# Altium project Sergeant_Soldiered.PrjPcb (part 2 of 2)

## Sheet TIA_SarSol.SchDoc
size Tabloid; DrawnBy: Nicholas Sandor; Revision: V26C (V26.4a); SheetNumber: 4; SheetTotal: 6
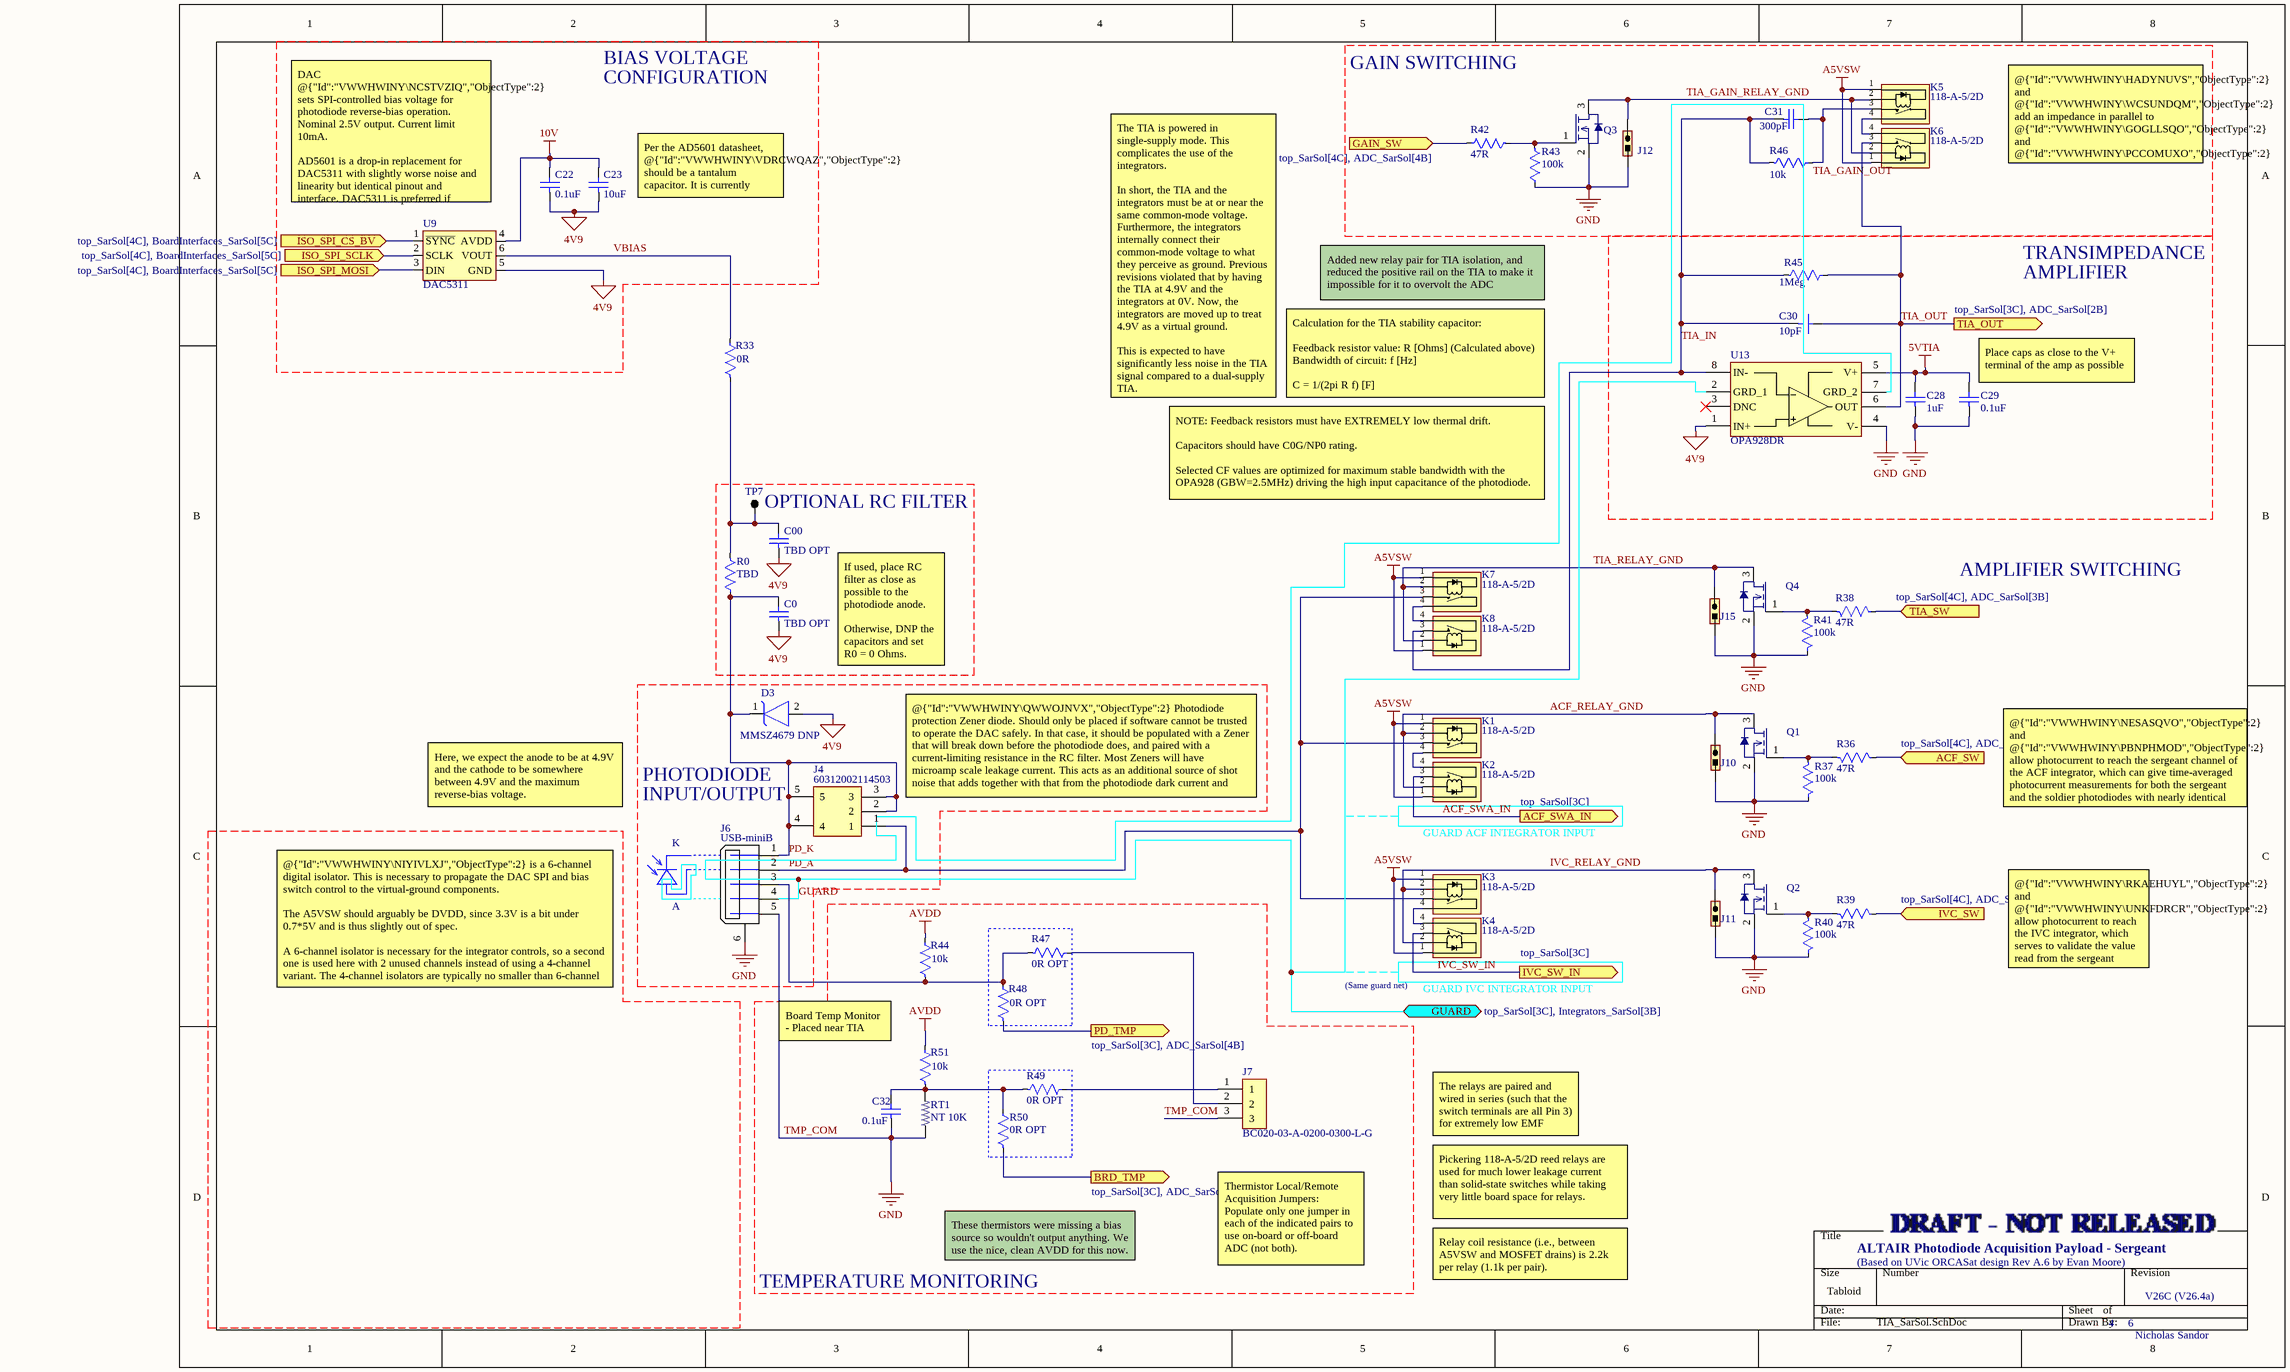
[diagram p3: TIA_SarSol.SchDoc]

### Parts
C00  TBD OPT  [CAP 0603 IPC MID DENSITY]
C0  TBD OPT  [CAP 0603 IPC MID DENSITY]
C22  0.1uF  [CAP 0603 IPC MID DENSITY]
C23  10uF  [CAP 1206 IPC LOW DENSITY]
C28  1uF  [CAP 0603 IPC MID DENSITY]
C29  0.1uF  [CAP 0603 IPC MID DENSITY]
C30  10pF  [CAP 1206 UNKNOWN]
C31  300pF  [CAP 1206 NON-IPC KEMET NP0]
C32  0.1uF  [CAP 0603 IPC MID DENSITY]
D3  MMSZ4679 DNP  [SOD-123 ONSEMI SMALL PADS]
J4  60312002114503  [COAX SMA THT]
J6  USB-miniB  [USB-miniB]
J7  BC020-03-A-0200-0300-L-G  [JUMPER 3POS 1MM PITCH THT]
J10  Jumper  [JUMPER 2POS 1MM PITCH THT]  (value not drawn)
J11  Jumper  [JUMPER 2POS 1MM PITCH THT]  (value not drawn)
J12  Jumper  [JUMPER 2POS 1MM PITCH THT]  (value not drawn)
J15  Jumper  [JUMPER 2POS 1MM PITCH THT]  (value not drawn)
K1  118-A-5/2D  [118-A-5/2D]
K2  118-A-5/2D  [118-A-5/2D]
K3  118-A-5/2D  [118-A-5/2D]
K4  118-A-5/2D  [118-A-5/2D]
K5  118-A-5/2D  [118-A-5/2D]
K6  118-A-5/2D  [118-A-5/2D]
K7  118-A-5/2D  [118-A-5/2D]
K8  118-A-5/2D  [118-A-5/2D]
Q1  DMG2302UK  [SOT90-3 LOW DENSITY]  (value not drawn)
Q2  DMG2302UK  [SOT90-3 LOW DENSITY]  (value not drawn)
Q3  DMG2302UK  [SOT90-3 LOW DENSITY]  (value not drawn)
Q4  DMG2302UK  [SOT90-3 LOW DENSITY]  (value not drawn)
R0  TBD  [RES 0603 IPC MID DENSITY]
R33  0R  [RES 0603 IPC MID DENSITY]
R36  47R  [RES 0603 IPC MID DENSITY]
R37  100k  [RES 0603 IPC MID DENSITY]
R38  47R  [RES 0603 IPC MID DENSITY]
R39  47R  [RES 0603 IPC MID DENSITY]
R40  100k  [RES 0603 IPC MID DENSITY]
R41  100k  [RES 0603 IPC MID DENSITY]
R42  47R  [RES 0603 IPC MID DENSITY]
R43  100k  [RES 0603 IPC MID DENSITY]
R44  10k  [RES 0603 IPC MID DENSITY]
R45  1Meg  [RES 1206 IPC MID DENSITY]
R46  10k  [RES 1206 IPC MID DENSITY]
R47  0R OPT  [RES 0603 IPC MID DENSITY]
R48  0R OPT  [RES 0603 IPC MID DENSITY]
R49  0R OPT  [RES 0603 IPC MID DENSITY]
R50  0R OPT  [RES 0603 IPC MID DENSITY]
R51  10k  [RES 0603 IPC MID DENSITY]
RT1  value NT 10K  [RES 0603 IPC MID DENSITY]  (hidden comment: NTC 0603 10K 1%)
TP7  Testpoint  [TESTPOINT THT]  (value not drawn)  (no BOM)
U9  DAC5311  [SOT363-6 MID DENSITY]
U13  OPA928DR  [8-SOIC 4MM WIDE MID DENSITY]

### Blocks framed on the sheet
GAIN SWITCHING: C31 J12 K5 K6 Q3 R42 R43 R46
OPTIONAL RC FILTER: C0 C00 R0 TP7
TEMPERATURE MONITORING: C32 J7 R44 R47-R51 RT1

### Ports
ACF_SW (in, see top_SarSol[4C], ADC_SarSol[3B]), ACF_SWA_IN (out, see top_SarSol[3C]), BRD_TMP (out, see top_SarSol[3C], ADC_SarSol[4B]), GAIN_SW (in, see top_SarSol[4C], ADC_SarSol[4B]), GUARD (bidir, see top_SarSol[3C], Integrators_SarSol[3B]), ISO_SPI_CS_BV (in, see top_SarSol[4C], BoardInterfaces_SarSol[5C]), ISO_SPI_MOSI (in, see top_SarSol[4C], BoardInterfaces_SarSol[5C]), ISO_SPI_SCLK (in, see top_SarSol[4C], BoardInterfaces_SarSol[5C]), IVC_SW (in, see top_SarSol[4C], ADC_SarSol[3B]), IVC_SW_IN (out, see top_SarSol[3C]), PD_TMP (out, see top_SarSol[3C], ADC_SarSol[4B]), TIA_OUT (out, see top_SarSol[3C], ADC_SarSol[2B]), TIA_SW (in, see top_SarSol[4C], ADC_SarSol[3B])

### Nets
4V9: C00.1 C0.1 C22.1 C23.1 D3.2(Anode) U9.5(GND) U13.1(IN+)
5VTIA: C28.2 C29.2 U13.5(V+)
10V: C22.2 C23.2 U9.4(AVDD)
A5VSW: K1.1 K2.1 K3.1 K4.1 K5.1 K6.1 K7.1 K8.1
AVDD: R44.2 R51.2
GND: C28.1 C29.1 C32.1 J6.5 J6.6(SHLD) J7.3 J10.1 J11.1 J12.1 J15.1 Q1.2(Source) Q2.2(Source) Q3.2(Source) Q4.2(Source) R37.2 R40.2 R41.2 R43.2 RT1.1 U13.4(V-)  [also labelled TMP_COM]  [project net SYS_GND]
ACF_RELAY_GND: J10.2 K1.2 K2.2 Q1.3(Drain)
ACF_SWA_IN: K2.3 ; port ACF_SWA_IN
GUARD: J6.4 U13.2(GRD_1) U13.7(GRD_2) ; port GUARD
IVC_RELAY_GND: J11.2 K3.2 K4.2 Q2.3(Drain)
IVC_SW_IN: K4.3 ; port IVC_SW_IN
PD_A: J4.1 J6.2 K1.3 K3.3 K7.3
PD_K: C0.2 D3.1(Cathode) J4.2 J4.3 J4.4 J4.5 J6.1 R0.2
TIA_GAIN_OUT: C31.2 K5.3 R46.2
TIA_GAIN_RELAY_GND: J12.2 K5.2 K6.2 Q3.3(Drain)
TIA_IN: C30.1 C31.1 K8.3 R45.1 R46.1 U13.8(IN-)
TIA_OUT: C30.2 K6.3 R45.2 U13.6(OUT) ; port TIA_OUT
TIA_RELAY_GND: J15.2 K7.2 K8.2 Q4.3(Drain)
VBIAS: R33.2 U9.6(VOUT)
NetC00_2: C00.2 R0.1 R33.1 TP7.1
NetC32_2: C32.2 R49.1 R50.2 R51.1 RT1.2
NetJ6_3: J6.3 R44.1 R47.1 R48.2
NetJ7_1: J7.1 R49.2
NetJ7_2: J7.2 R47.2
NetK1_4: K1.4 K2.4
NetK3_4: K3.4 K4.4
NetK5_4: K5.4 K6.4
NetK7_4: K7.4 K8.4
NetQ1_1: Q1.1(Gate) R36.1 R37.1
NetQ2_1: Q2.1(Gate) R39.1 R40.1
NetQ3_1: Q3.1(Gate) R42.1 R43.1
NetQ4_1: Q4.1(Gate) R38.1 R41.1
NetR36_2: R36.2 ; port ACF_SW
NetR38_2: R38.2 ; port TIA_SW
NetR39_2: R39.2 ; port IVC_SW
NetR42_2: R42.2 ; port GAIN_SW
NetR48_1: R48.1 ; port PD_TMP
NetR50_1: R50.1 ; port BRD_TMP
NetU9_1: U9.1(~{SYNC}) ; port ISO_SPI_CS_BV
NetU9_2: U9.2(SCLK) ; port ISO_SPI_SCLK
NetU9_3: U9.3(DIN) ; port ISO_SPI_MOSI

Not connected (* = marked no-connect by the designer): U13 3(DNC)*

### Notes on the sheet
- BIAS VOLTAGE
- CONFIGURATION
- DAC @{"Id":"VWWHWINY\NCSTVZIQ","ObjectType":2} sets SPI-controlled bias voltage for photodiode reverse-bias operation. Nominal 2.5V output. Current limit 10mA.
  AD5601 is a drop-in replacement for DAC5311 with slightly worse noise and linearity but identical pinout and interface. DAC5311 is preferred if available.
- (near C23) Per the AD5601 datasheet, @{"Id":"VWWHWINY\VDRCWQAZ","ObjectType":2} should be a tantalum capacitor. It is currently specified as an MLCC.
- @{"Id":"VWWHWINY\HADYNUVS","ObjectType":2} and @{"Id":"VWWHWINY\WCSUNDQM","ObjectType":2} add an impedance in parallel to @{"Id":"VWWHWINY\GOGLLSQO","ObjectType":2} and @{"Id":"VWWHWINY\PCCOMUXO","ObjectType":2} to lower the gain of the TIA, which measures the photocurrent in the case where the laser is not being pulsed.
- TRANSIMPEDANCE
- Added new relay pair for TIA isolation, and reduced the positive rail on the TIA to make it impossible for it to overvolt the ADC
- AMPLIFIER
- The TIA is powered in single-supply mode. This complicates the use of the integrators.
  In short, the TIA and the integrators must be at or near the same common-mode voltage. Furthermore, the integrators internally connect their common-mode voltage to what they perceive as ground. Previous revisions violated that by having the TIA at 4.9V and the integrators at 0V. Now, the integrators are moved up to treat 4.9V as a virtual ground.
  This is expected to have significantly less noise in the TIA signal compared to a dual-supply TIA.
- Calculation for the TIA stability capacitor:
  Feedback resistor value: R [Ohms] (Calculated above)
  Bandwidth of circuit: f [Hz]
  C = 1/(2pi R f) [F]
- (near C29) Place caps as close to the V+ terminal of the amp as possible
- NOTE: Feedback resistors must have EXTREMELY low thermal drift.
  Capacitors should have C0G/NP0 rating.
  Selected CF values are optimized for maximum stable bandwidth with the OPA928 (GBW=2.5MHz) driving the high input capacitance of the photodiode.
- AMPLIFIER SWITCHING
- If used, place RC filter as close as possible to the photodiode anode.
  Otherwise, DNP the capacitors and set R0 = 0 Ohms.
- Here, we expect the anode to be at 4.9V and the cathode to be somewhere between 4.9V and the maximum reverse-bias voltage.
- PHOTODIODE
- INPUT/OUTPUT
- (near J4) @{"Id":"VWWHWINY\QWWOJNVX","ObjectType":2} Photodiode protection Zener diode. Should only be placed if software cannot be trusted to operate the DAC safely. In that case, it should be populated with a Zener that will break down before the photodiode does, and paired with a current-limiting resistance in the RC filter. Most Zeners will have microamp scale leakage current. This acts as an additional source of shot noise that adds together with that from the photodiode dark current and limits measurement precision.
- GUARD ACF INTEGRATOR INPUT
- @{"Id":"VWWHWINY\NESASQVO","ObjectType":2} and @{"Id":"VWWHWINY\PBNPHMOD","ObjectType":2} allow photocurrent to reach the sergeant channel of the ACF integrator, which can give time-averaged photocurrent measurements for both the sergeant and the soldier photodiodes with nearly identical characteristics between the two.
- K
- A
- @{"Id":"VWWHWINY\NIYIVLXJ","ObjectType":2} is a 6-channel digital isolator. This is necessary to propagate the DAC SPI and bias switch control to the virtual-ground components.
  The A5VSW should arguably be DVDD, since 3.3V is a bit under 0.7*5V and is thus slightly out of spec.
  A 6-channel isolator is necessary for the integrator controls, so a second one is used here with 2 unused channels instead of using a 4-channel variant. The 4-channel isolators are typically no smaller than 6-channel isolators.
- (near K4) (Same guard net)
- (near K4) GUARD IVC INTEGRATOR INPUT
- @{"Id":"VWWHWINY\RKAEHUYL","ObjectType":2} and @{"Id":"VWWHWINY\UNKFDRCR","ObjectType":2} allow photocurrent to reach the IVC integrator, which serves to validate the value read from the sergeant channel of the ACF.
- Board Temp Monitor
  - Placed near TIA
- The relays are paired and wired in series (such that the switch terminals are all Pin 3) for extremely low EMF
- These thermistors were missing a bias source so wouldn't output anything. We use the nice, clean AVDD for this now.
- Thermistor Local/Remote Acquisition Jumpers:
  Populate only one jumper in each of the indicated pairs to use on-board or off-board ADC (not both).
- Pickering 118-A-5/2D reed relays are used for much lower leakage current than solid-state switches while taking very little board space for relays.
- ALTAIR Photodiode Acquisition Payload - Sergeant
- (Based on UVic ORCASat design Rev A.6 by Evan Moore)
- Relay coil resistance (i.e., between A5VSW and MOSFET drains) is 2.2k per relay (1.1k per pair).

### Library data of the parts
C00 C0 = CAP: Murata GRT188R61H105KE13D - Cap Ceramic 1uF 10% 50V X5R 0603 (Placeholder); MF: Murata; MP: GRT188R61H105KE13D
C22 C29 C32 = CAP: as C5 on sheet Power_SarSol; MF: Kemet; MP: C0603C104K5RACAUTO
C23 = CAP: Murata GRT319R6YA106KE01D - Cap Ceramic 10uF 35V X5R 10% Pad SMD 1206 85C Automotive T/R; MF: Murata; MP: GRT319R6YA106KE01D
C28 = CAP: Murata GRT188R61H105KE13D - Cap MLCC AEC-Q200 X5R 1uF 50V 0603; MF: Murata; MP: GRT188R61H105KE13D
C30 = CAP: Wurth Elektronik 885012008037 - Cap Ceramic 10pF 5% 50V NP0 1206; MF: Wurth Elektronik; MP: 885012008037
C31 = CAP: Kemet C1206C301K5GACTU - Cap Ceramic 300pF 10% 50V NP0 1206; MF: Kemet; MP: C1206C301K5GACTU
D3 = Zener: DIODE ZENER SOD123; MF: onsemi; MP: MMSZ4679T1G
J4 = 60312002114503: Coaxial, SMA Female Jack, 50 Ohm, Through-Hole; MF: Wurth Elektronik; Datasheet Link: https://katalog.we-online.de/em/datasheet/60312002114503.pdf; Height: 9.56mm; MP: 60312002114503; Mouser Part Number: 710-60312002114503; Mouser Price/Stock: https://www.mouser.co.uk/ProductDetail/Wurth-Elektronik/60312002114503?qs=3jNSNtuqJTL%2FGpZA1FAOxw%3D%3D
J6 = USB-miniB: Conn Mini-USB RCP 5 POS Solder ST Thru-Hole 5 Terminal 1 Port; Number of Positions: 5; Gender: Female; MF: Amphenol Commercial; MP: UE25BE5510H; RoHS: Yes; Category: USB Connectors; Stock 1: 6446; Mount: Through Hole; Color: Black; Contact Material: Copper Alloy; Contact Plating: Gold; Number of Contacts: 5; Termination: PCB; Features: High Temperature; Lead Free: Lead Free; Flammability Rating: UL94 V-0; ComponentLink1URL: http://components.arrow.com/part/dataview/0323_00956300?src-supplier=Arrow+Europe; ComponentLink1Description: http://components.arrow.com/part/dataview/0323_00956300?src-supplier=Arrow+Europe; ComponentLink2URL: http://www.alliedelec.com/m/d/e7e3d7a920045eebbdef787e60d8b001.pdf?src-supplier=Allied+Electronics; ComponentLink2Description: http://www.alliedelec.com/m/d/e7e3d7a920045eebbdef787e60d8b001.pdf?src-supplier=Allied+Electronics; ComponentLink3URL: https://www.amphenolcanada.com/ProductSearch/drawings/AC/UE25BEX510X.pdf?src-supplier=Digi-Key; ComponentLink3Description: https://www.amphenolcanada.com/ProductSearch/drawings/AC/UE25BEX510X.pdf?src-supplier=Digi-Key; Supplier 1: Digi-Key; Supplier Part Number 1: UE25BE5510H-ND
J7 = BC020-03-A-0200-0300-L-G: 3x1 Header SMD; MF: GCT (GLOBAL CONNECTOR TECHNOLOGY); Datasheet Link: https://www.mouser.com/datasheet/2/837/BC020-1948594.pdf; Height: 3.2mm; MP: BC020-03-A-0200-0300-L-G
J10-J12 J15 = Jumper 2POS: Header 2Pos THT 2.54mm Pitch; MF: Samtec Inc.; MP: TSW-101-23-G-D; Supplier 1: Digi-Key; Supplier Part Number 1: SAM1068-01-ND; Operating Temperature: -55°C ~ 125°C
K1-K8 = RELAY 118-A-5/2D: High coil resistance SIL/SIP Reed Relay 118-A-5/2D; MF: Pickering; MP: 118-1-A-5/2D
Q1-Q4 = NMOS DMG2302UK: DIODES INC. Power MOSFET, N Channel, 20 V, 2.8 A, 0.061 ohm, SOT-23, Surface Mount; MP: DMG2302UK-7; ComponentLink1URL: http://www.farnell.com/datasheets/2814387.pdf?src-supplier=Farnell; ComponentLink1Description: http://www.farnell.com/datasheets/2814387.pdf?src-supplier=Farnell; ComponentLink2URL: http://www.farnell.com/datasheets/2814387.pdf?src-supplier=Element14; ComponentLink2Description: http://www.farnell.com/datasheets/2814387.pdf?src-supplier=Element14; ComponentLink3URL: https://www.diodes.com/assets/Datasheets/DMG2302UK.pdf?src-supplier=Digi-Key; ComponentLink3Description: https://www.diodes.com/assets/Datasheets/DMG2302UK.pdf?src-supplier=Digi-Key; ComponentLink4URL: http://www.farnell.com/datasheets/2814387.pdf?src-supplier=Newark; ComponentLink4Description: http://www.farnell.com/datasheets/2814387.pdf?src-supplier=Newark; Supplier 1: Digi-Key; Supplier Part Number 1: DMG2302UK-7DICT-ND; MF: Diodes
R0 = RES: as R3 on sheet BoardInterfaces_SarSol; MF: YAGEO; MP: RC0402JR-070RL
R33 R47-R50 = RES: Vishay CRCW06030000Z0EA - Res 0 Ohms 1/8W SMD 0603; MF: Vishay Dale; MP: CRCW06030000Z0EA
R36 R38 R39 R42 = RES: Vishay CRCW060347R0JNEA - Res 47Ohm 5% 1/8W SMD 0603; MF: Vishay Dale; MP: CRCW060347R0JNEA
R37 R40 R41 R43 = RES: Panasonic ERJ-3GEYJ104V - Res 100k 5% 1/10W SMD 0603; MF: Panasonic Electronic Components; MP: ERJ-3GEYJ104V
R44 R51 = RES
R45 = RES: Vishay TNPV12061M00BYEN - Res 1MOhm 0.1% 1/4W SMD 1206; MF: Vishay Dale; MP: TNPV12061M00BYEN
R46 = RES: Stackpole RNCF1206TKY10K0 - Res 10k 0.01% 1/4W SMD 1206; MF: Stackpole Electronics Inc.; MP: RNCF1206TKY10K0
RT1 = THERM_RES NTC 0603 10K 1%: THERMISTOR NTC 10KOHM 3380K 0603; MF: Murata; MP: NCU18XH103F60RB; RoHS: No; Category: Thermistors; Stock 1: 48580; Case/Package: 0603; Case Code (Metric): 1608; Case Code (Imperial): 0603; Min Operating Temperature: -40°C; Max Operating Temperature: 125°C; REACH SVHC: No SVHC; ComponentLink1URL: http://www.farnell.com/datasheets/2095755.pdf?src-supplier=Farnell; ComponentLink1Description: http://www.farnell.com/datasheets/2095755.pdf?src-supplier=Farnell; ComponentLink2URL: https://www.murata.com/en-us/products/productdata/8796836233246/L0770E.pdf?src-supplier=Digi-Key; ComponentLink2Description: https://www.murata.com/en-us/products/productdata/8796836233246/L0770E.pdf?src-supplier=Digi-Key; ComponentLink3URL: http://www.farnell.com/datasheets/2095755.pdf?src-supplier=Element14; ComponentLink3Description: http://www.farnell.com/datasheets/2095755.pdf?src-supplier=Element14; Supplier 1: Digi-Key; Supplier Part Number 1: 490-16279-1-ND
U9 = DAC5311: DAC 8bit 1 channel SPI Supply Reference Buffered Voltage; MF: Texas Instruments; MP: DAC5311IDCKR
U13 = OPA928DR: Op Amp, 36V, fA input, precision, e-trim; MF: Texas Instruments; Datasheet Link: https://www.ti.com/lit/ds/symlink/opa928.pdf?HQS=dis-mous-null-mousermode-dsf-pf-null-wwe&ts=1731036524091&ref_url=https%253A%252F%252Fwww.ti.com%252Fgeneral%252Fdocs%252Fsuppproductinfo.tsp%253FdistId%253D26%2526gotoUrl%253Dhttps%253A%252F%252Fwww.ti.com; Height: 1.75mm; MP: OPA928DR; Mouser Part Number: 595-OPA928DR; Mouser Price/Stock: https://www.mouser.co.uk/ProductDetail/Texas-Instruments/OPA928DR?qs=2wMNvWM5ZX5RgAZJHoeYSw%3D%3D; Arrow Part Number: OPA928DR; Arrow Price/Stock: null?region=nac

## Sheet Integrators_SarSol.SchDoc
size Tabloid; SheetNumber: 5; SheetTotal: 6
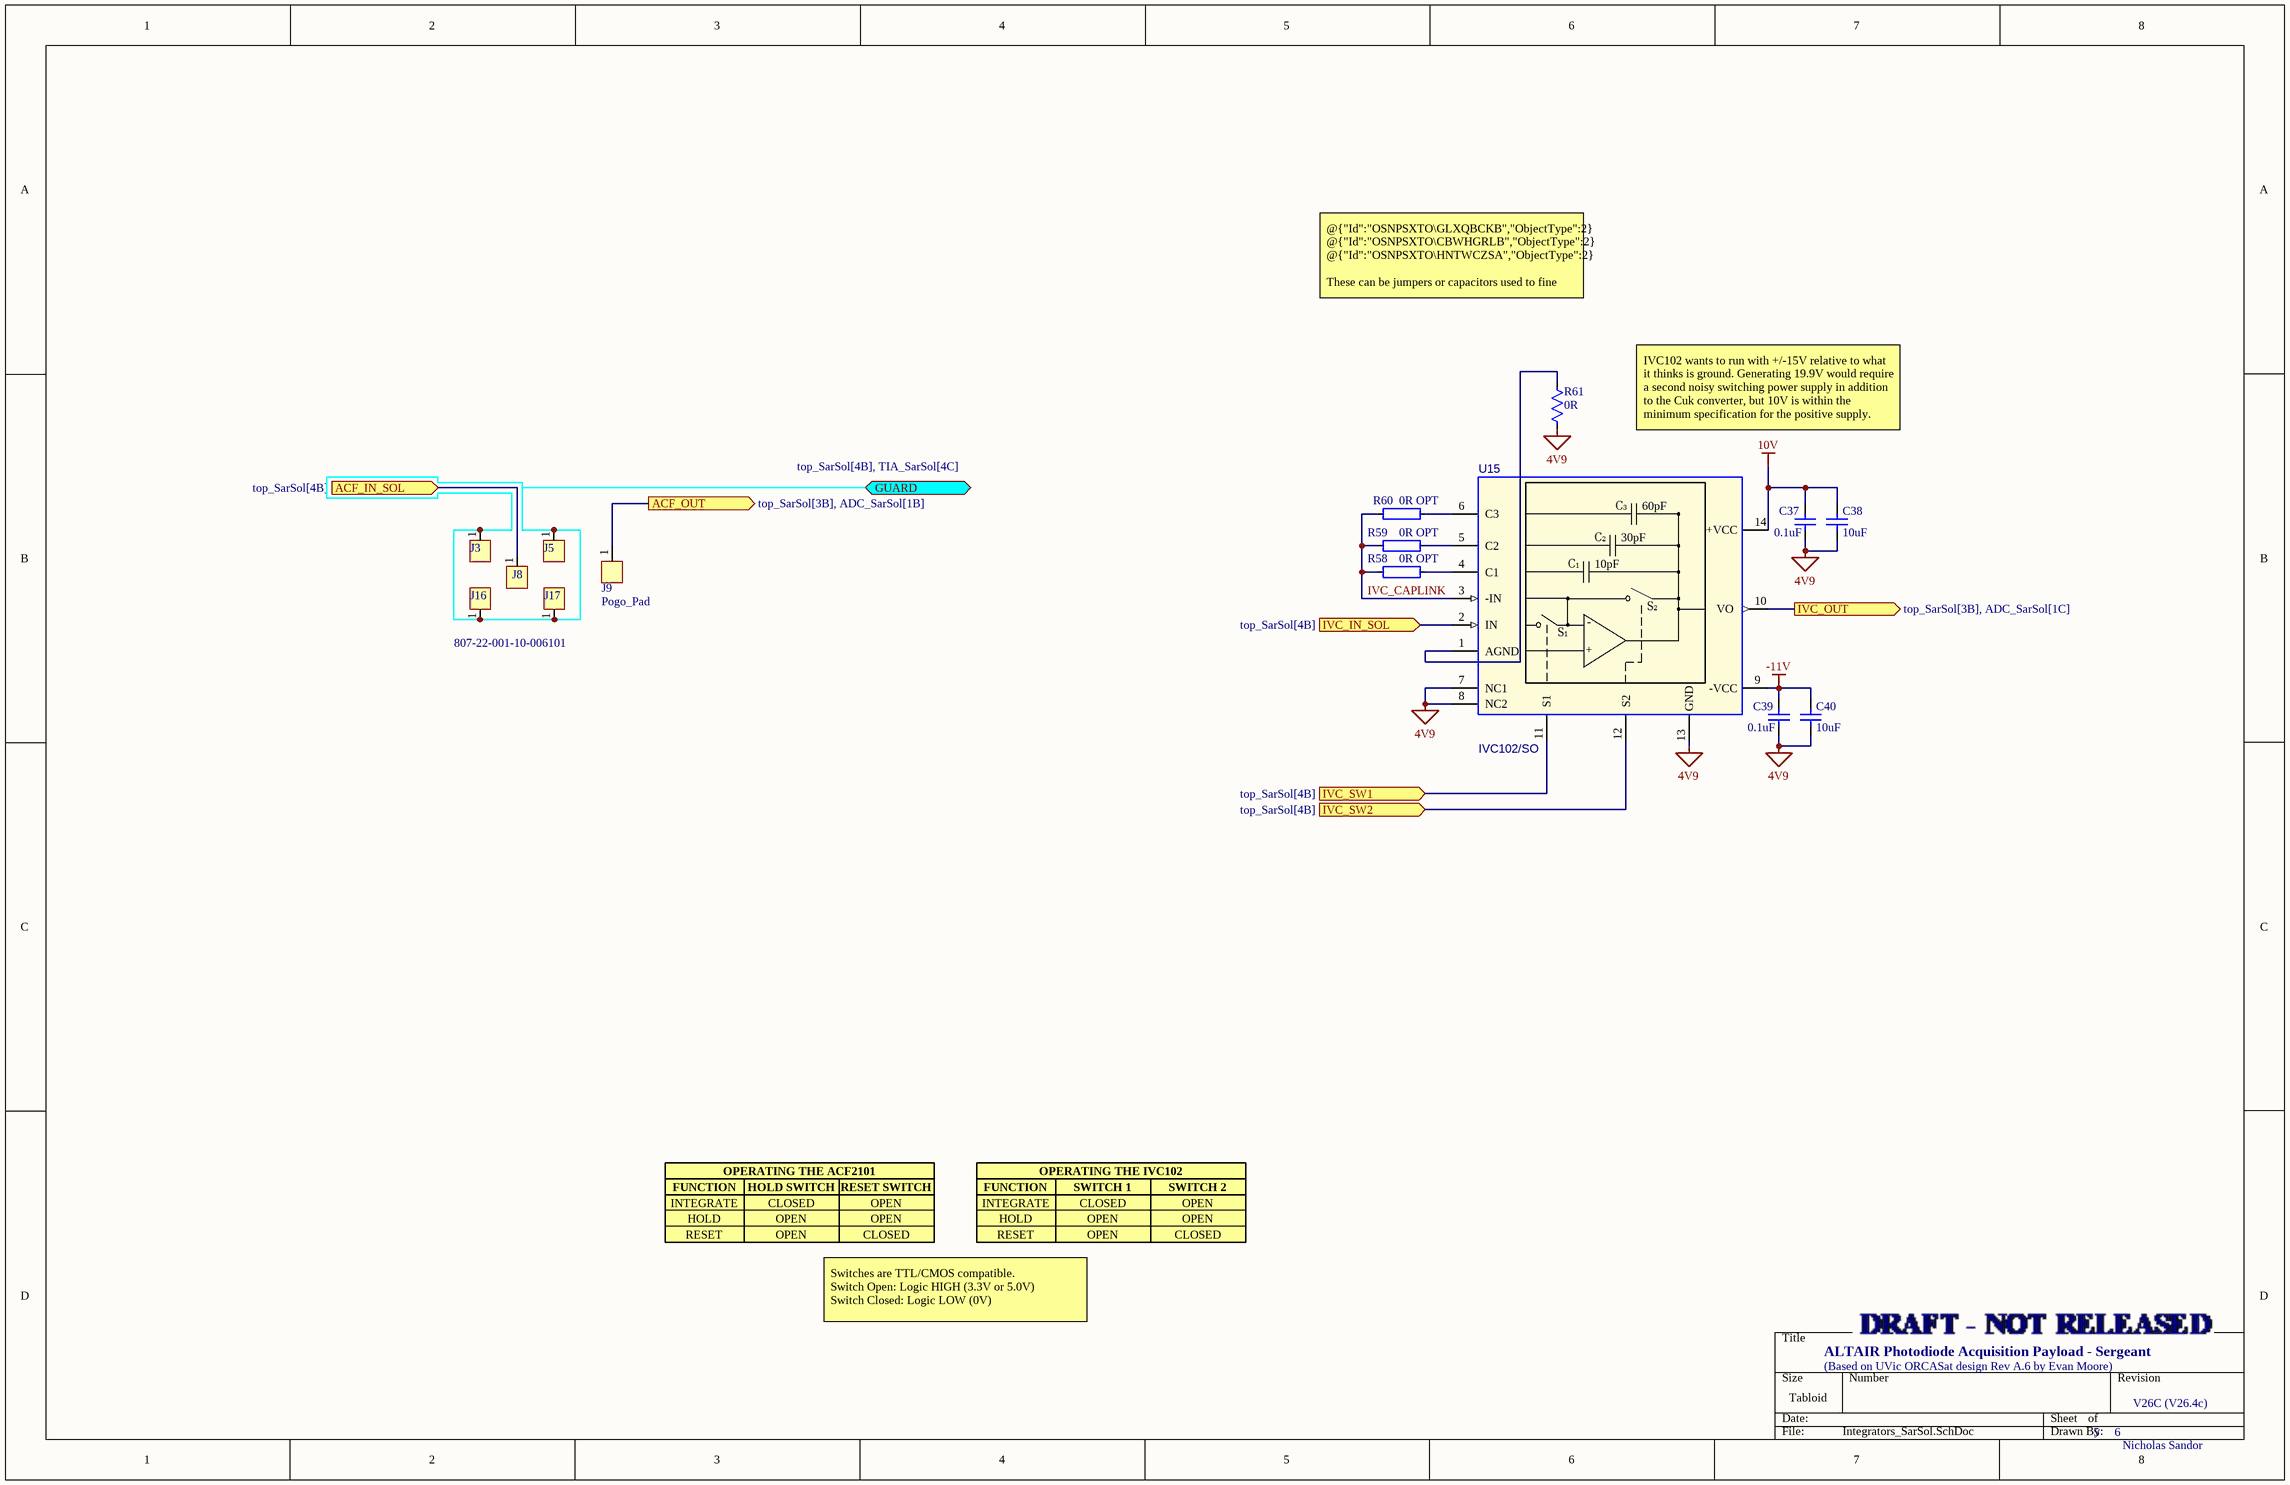
[diagram p4: Integrators_SarSol.SchDoc]

### Parts
C37  0.1uF  [CAP 0603 NON-IPC KEMET X7R]
C38  10uF  [CAP 0805 IPC MID DENSITY]
C39  0.1uF  [CAP 0603 NON-IPC KEMET X7R]
C40  10uF  [CAP 0805 IPC MID DENSITY]
J3  807-22-001-10-006101  [POGO PIN 807-22-001-10-006101]  (value not drawn)
J5  807-22-001-10-006101  [POGO PIN 807-22-001-10-006101]  (value not drawn)
J8  807-22-001-10-006101  [POGO PIN 807-22-001-10-006101]
J9  Pogo_Pad  [POGO PAD SOLDIER]  (no BOM)
J16  807-22-001-10-006101  [POGO PIN 807-22-001-10-006101]  (value not drawn)
J17  807-22-001-10-006101  [POGO PIN 807-22-001-10-006101]  (value not drawn)
R58  0R OPT  [RES 0402 IPC LOW DENSITY]
R59  0R OPT  [RES 0402 IPC LOW DENSITY]
R60  0R OPT  [RES 0402 IPC LOW DENSITY]
R61  0R  [RES 0402 IPC MID DENSITY]
U15  IVC102/SO  [14-SOIC 4MM WIDE LOW DENSITY]

### Ports
ACF_IN_SOL (in, see top_SarSol[4B]), ACF_OUT (out, see top_SarSol[3B], ADC_SarSol[1B]), GUARD (bidir, see top_SarSol[4B], TIA_SarSol[4C]), IVC_IN_SOL (in, see top_SarSol[4B]), IVC_OUT (out, see top_SarSol[3B], ADC_SarSol[1C]), IVC_SW1 (in, see top_SarSol[4B]), IVC_SW2 (in, see top_SarSol[4B])

### Nets
4V9: C37.1 C38.1 C39.1 C40.1 R61.2 U15.7(NC1) U15.8(NC2) U15.13(GND)
10V: C37.2 C38.2 U15.14(+VCC)
-11V: C39.2 C40.2 U15.9(-VCC)
ACF_SWA_IN: J8.1 ; port ACF_IN_SOL
GUARD: J3.1 J5.1 J16.1 J17.1 ; port GUARD
IVC_CAPLINK: R58.1 R59.1 R60.1 U15.3(-IN)
IVC_SW_IN: U15.2(IN) ; port IVC_IN_SOL
NetJ9_1: J9.1 ; port ACF_OUT
NetR58_2: R58.2 U15.4(C1)
NetR59_2: R59.2 U15.5(C2)
NetR60_2: R60.2 U15.6(C3)
NetR61_1: R61.1 U15.1(AGND)
NetU12_11: U15.12(S2) ; port IVC_SW2
NetU12_12: U15.11(S1) ; port IVC_SW1
NetU15_10: U15.10(VO) ; port IVC_OUT

### Notes on the sheet
- @{"Id":"OSNPSXTO\GLXQBCKB","ObjectType":2} @{"Id":"OSNPSXTO\CBWHGRLB","ObjectType":2} @{"Id":"OSNPSXTO\HNTWCZSA","ObjectType":2}
  These can be jumpers or capacitors used to fine tune the IVC's response. At least one must be populated to close the op-amp feedback loop.
- IVC102 wants to run with +/-15V relative to what it thinks is ground. Generating 19.9V would require a second noisy switching power supply in addition to the Cuk converter, but 10V is within the minimum specification for the positive supply.
- FUNCTION
- INTEGRATE
- HOLD
- RESET
- OPERATING THE ACF2101
- HOLD SWITCH
- CLOSED
- OPEN
- RESET SWITCH
- OPERATING THE IVC102
- SWITCH 1
- SWITCH 2
- Switches are TTL/CMOS compatible.
  Switch Open: Logic HIGH (3.3V or 5.0V)
  Switch Closed: Logic LOW (0V)
- ALTAIR Photodiode Acquisition Payload - Sergeant
- (Based on UVic ORCASat design Rev A.6 by Evan Moore)
- (in symbol IVC102/SO_5) C₃; 60pF; C₂; 30pF; C₁; 10pF; S₂; -; S₁; +

### Library data of the parts
C37 C39 = CAP: as C5 on sheet Power_SarSol; MF: Kemet; MP: C0603C104K5RACAUTO
C38 C40 = CAP: as C6 on sheet Power_SarSol; MF: Murata; MP: GRM21BR61E106KA73L
J3 J5 J8 J16 J17 = 807-22-001-10-006101: Mill-Max Individual Insulated Pin 5.99mm Initial Height; MF: Mill-Max; MP: 807-22-001-10-006101
J9 = Pogo_Pad_NoGuard: Pad for Pogo Pin without Guard
R58-R60 = IMPEDANCE: Yageo RC0402JR-070RL - Res 0 Ohms 1/16W SMD 0402; MF: YAGEO; MP: RC0402JR-070RL
R61 = RES: as R3 on sheet BoardInterfaces_SarSol; MF: YAGEO; MP: RC0402JR-070RL
U15 = IVC102/SO_5: Precision Switched Integrator Transimpedance Amplifier; Part Reference: U1; MF: Texas Instruments; MP: IVC102U; Value: IVC102/SO

## Sheet ADC_SarSol.SchDoc
size Tabloid; SheetNumber: 6; SheetTotal: 6
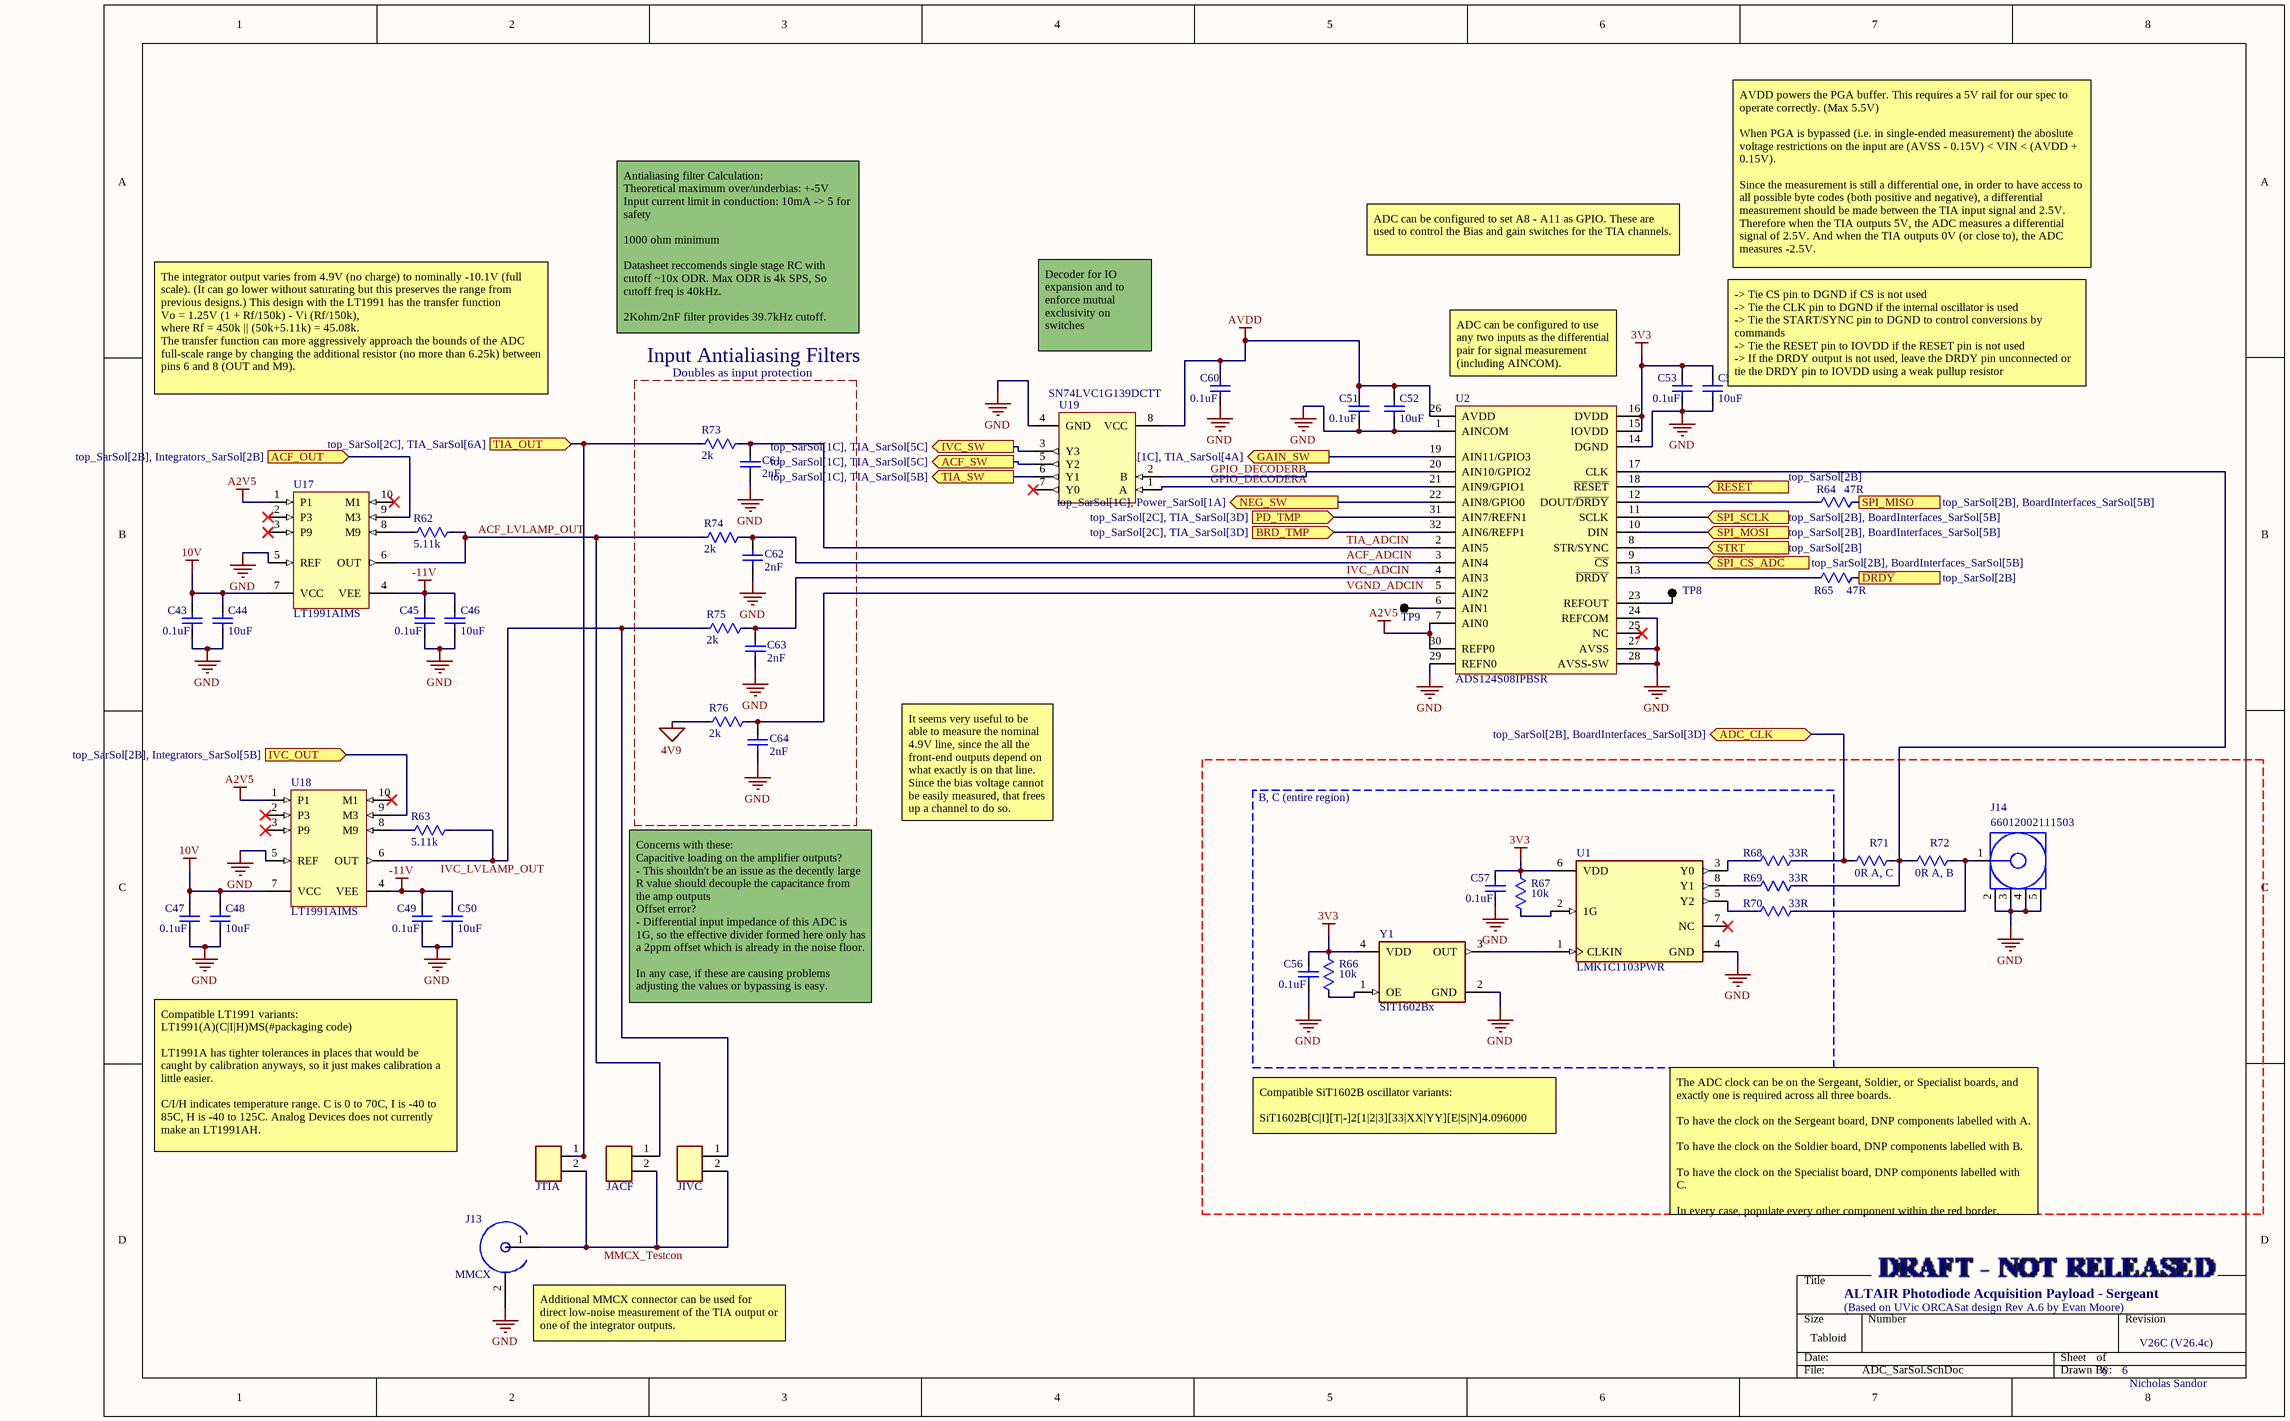
[diagram p5: ADC_SarSol.SchDoc]

### Parts
C43  0.1uF  [CAP 0603 NON-IPC KEMET X7R]
C44  10uF  [CAP 0805 IPC MID DENSITY]
C45  0.1uF  [CAP 0603 NON-IPC KEMET X7R]
C46  10uF  [CAP 0805 IPC MID DENSITY]
C47  0.1uF  [CAP 0603 NON-IPC KEMET X7R]
C48  10uF  [CAP 0805 IPC MID DENSITY]
C49  0.1uF  [CAP 0603 NON-IPC KEMET X7R]
C50  10uF  [CAP 0805 IPC MID DENSITY]
C51  0.1uF  [CAP 0603 IPC MID DENSITY]
C52  10uF  [CAP 0805 IPC MID DENSITY]
C53  0.1uF  [CAP 0603 IPC MID DENSITY]
C54  10uF  [CAP 0805 IPC MID DENSITY]
C56  0.1uF  [CAP 0603 IPC MID DENSITY]
C57  0.1uF  [CAP 0603 IPC MID DENSITY]
C60  0.1uF  [CAP 0603 IPC MID DENSITY]
C61  2nF  [CAP 0603 IPC MID DENSITY]
C62  2nF  [CAP 0603 IPC MID DENSITY]
C63  2nF  [CAP 0603 IPC MID DENSITY]
C64  2nF  [CAP 0603 IPC MID DENSITY]
J13  MMCX  [COAX MMCX SMD]
J14  66012002111503  [COAX MMCX THT]
JACF  JACF  [JUMPER 2POS 1MM PITCH THT]  (value not drawn)
JIVC  JIVC  [JUMPER 2POS 1MM PITCH THT]  (value not drawn)
JTIA  JTIA  [JUMPER 2POS 1MM PITCH THT]  (value not drawn)
R62  5.11k  [RES 0402 IPC MID DENSITY]
R63  5.11k  [RES 0402 IPC MID DENSITY]
R64  47R  [RES 0402 NON-IPC SEI]
R65  47R  [RES 0402 NON-IPC SEI]
R66  10k  [RES 0603 IPC MID DENSITY]
R67  10k  [RES 0603 IPC MID DENSITY]
R68  33R  [RES 0402 NON-IPC YAGEO]
R69  33R  [RES 0402 NON-IPC YAGEO]
R70  33R  [RES 0402 NON-IPC YAGEO]
R71  0R A, C  [RES 0402 IPC MID DENSITY]
R72  0R A, B  [RES 0402 IPC MID DENSITY]
R73  2k  [RES 0603 IPC MID DENSITY]
R74  2k  [RES 0603 IPC MID DENSITY]
R75  2k  [RES 0603 IPC MID DENSITY]
R76  2k  [RES 0603 IPC MID DENSITY]
TP8  Testpoint  [TESTPOINT THT]  (value not drawn)  (no BOM)
TP9  Testpoint  [TESTPOINT THT]  (value not drawn)  (no BOM)
U1  LMK1C1103PWR  [8-TSSOP 0.65MM PITCH 4.4MM WIDTH IPC MID DENSITY]
U2  ADS124S08IPBSR  [32TQFP 7X7MM IPC LOW DENSITY]
U17  LT1991AIMS  [10-SOP 0.5MM PITCH 3MM WIDTH IPC HIGH DENSITY]
U18  LT1991AIMS  [10-SOP 0.5MM PITCH 3MM WIDTH IPC HIGH DENSITY]
U19  SN74LVC1G139DCTT  [DCT0008A_L]
Y1  SIT1602Bx  [4PQFN NON-IPC SITIME]

### Blocks framed on the sheet
Input Antialiasing Filters: C61-C64 R73-R76
B, C (entire region): C56 C57 R66-R70 U1 Y1

### Ports
ACF_OUT (in, see top_SarSol[2B], Integrators_SarSol[2B]), ACF_SW (out, see top_SarSol[1C], TIA_SarSol[5C]), ADC_CLK (bidir, see top_SarSol[2B], BoardInterfaces_SarSol[3D]), BRD_TMP (in, see top_SarSol[2C], TIA_SarSol[3D]), GAIN_SW (out, see top_SarSol[1C], TIA_SarSol[4A]), IVC_OUT (in, see top_SarSol[2B], Integrators_SarSol[5B]), IVC_SW (out, see top_SarSol[1C], TIA_SarSol[5C]), NEG_SW (out, see top_SarSol[1C], Power_SarSol[1A]), PD_TMP (in, see top_SarSol[2C], TIA_SarSol[3D]), SPI_MISO (out, see top_SarSol[2B], BoardInterfaces_SarSol[5B]), SPI_MOSI (in, see top_SarSol[2B], BoardInterfaces_SarSol[5B]), SPI_SCLK (in, see top_SarSol[2B], BoardInterfaces_SarSol[5B]), STRT (in, see top_SarSol[2B]), TIA_OUT (in, see top_SarSol[2C], TIA_SarSol[6A]), TIA_SW (out, see top_SarSol[1C], TIA_SarSol[5B]), ~{DRDY} (out, see top_SarSol[2B]), ~{RESET} (in, see top_SarSol[2B]), ~{SPI_CS_ADC} (in, see top_SarSol[2B], BoardInterfaces_SarSol[5B])

### Nets
3V3: C53.2 C54.2 C56.2 C57.2 R66.2 R67.2 U1.6(VDD) U2.15(IOVDD) U2.16(DVDD) Y1.4(VDD)
4V9: R76.1
10V: C43.2 C44.2 C47.2 C48.2 U17.7(VCC) U18.7(VCC)
-11V: C45.2 C46.2 C49.2 C50.2 U17.4(VEE) U18.4(VEE)
A2V5: U2.7(AIN0) U2.30(REFP0) U17.1(P1) U18.1(P1)
AVDD: C51.2 C52.2 C60.2 U2.26(AVDD) U19.8(VCC)
GND: C43.1 C44.1 C45.1 C46.1 C47.1 C48.1 C49.1 C50.1 C51.1 C52.1 C53.1 C54.1 C56.1 C57.1 C60.1 C61.1 C62.1 C63.1 C64.1 J13.2 J14.2(GND) J14.3(GND) J14.4(GND) J14.5(GND) U1.4(GND) U2.1(AINCOM) U2.14(DGND) U2.24(REFCOM) U2.27(AVSS) U2.28(AVSS-SW) U2.29(REFN0) U17.5(REF) U18.5(REF) U19.4(GND) Y1.2(GND)  [project net SYS_GND]
ACF_ADCIN: C62.2 R74.2 U2.3(AIN4)
ACF_LVLAMP_OUT: JACF.1 R62.2 R74.1 U17.6(OUT)
ADC_CLK: R68.1 R71.2 ; port ADC_CLK
GPIO_DECODERA: U2.21(AIN9/GPIO1) U19.1(A)
GPIO_DECODERB: U2.20(AIN10/GPIO2) U19.2(B)
IVC_ADCIN: C63.2 R75.2 U2.4(AIN3)
IVC_LVLAMP_OUT: JIVC.1 R63.2 R75.1 U18.6(OUT)
MMCX_Testcon: J13.1 JACF.2 JIVC.2 JTIA.2
NEG_SW: U2.22(AIN8/GPIO0) ; port NEG_SW
rSPI_MOSI: U2.10(DIN) ; port SPI_MOSI
rSPI_SCLK: U2.11(SCLK) ; port SPI_SCLK
SPI_MISO: R64.2 ; port SPI_MISO
TIA_ADCIN: C61.2 R73.2 U2.2(AIN5)
TIA_OUT: JTIA.1 R73.1 ; port TIA_OUT
VGND_ADCIN: C64.2 R76.2 U2.5(AIN2)
NetJ9_1: U17.9(M3) ; port ACF_OUT
NetJ14_1: J14.1(Signal) R70.1 R72.1
NetR1_2: U2.18(~{RESET}) ; port ~{RESET}
NetR3_2: R65.2 ; port ~{DRDY}
NetR6_2: U2.8(STR/SYNC) ; port STRT
NetR12_2: U2.9(~{CS}) ; port ~{SPI_CS_ADC}
NetR36_2: U19.5(Y2) ; port ACF_SW
NetR38_2: U19.6(Y1) ; port TIA_SW
NetR39_2: U19.3(Y3) ; port IVC_SW
NetR42_2: U2.19(AIN11/GPIO3) ; port GAIN_SW
NetR48_1: U2.31(AIN7/REFN1) ; port PD_TMP
NetR50_1: U2.32(AIN6/REFP1) ; port BRD_TMP
NetR62_1: R62.1 U17.8(M9)
NetR63_1: R63.1 U18.8(M9)
NetR64_1: R64.1 U2.12(DOUT/~{DRDY})
NetR65_1: R65.1 U2.13(~{DRDY})
NetR66_1: R66.1 Y1.1(OE)
NetR67_1: R67.1 U1.2(1G)
NetR68_2: R68.2 U1.3(Y0)
NetR69_1: R69.1 R71.1 R72.2 U2.17(CLK)
NetR69_2: R69.2 U1.8(Y1)
NetR70_2: R70.2 U1.5(Y2)
NetTP8_1: TP8.1 U2.23(REFOUT)
NetTP9_1: TP9.1 U2.6(AIN1)
NetU1_1: U1.1(CLKIN) Y1.3(OUT)
NetU15_10: U18.9(M3) ; port IVC_OUT

Not connected (* = marked no-connect by the designer): U1 7(NC)*; U2 25(NC)*; U17 2(P3)* 3(P9)* 10(M1)*; U18 2(P3)* 3(P9)* 10(M1)*; U19 7(Y0)*

### Notes on the sheet
- ADC can be configured to set A8 - A11 as GPIO. These are used to control the Bias and gain switches for the TIA channels.
- AVDD powers the PGA buffer. This requires a 5V rail for our spec to operate correctly. (Max 5.5V)
  When PGA is bypassed (i.e. in single-ended measurement) the aboslute voltage restrictions on the input are (AVSS - 0.15V) < VIN < (AVDD + 0.15V).
  Since the measurement is still a differential one, in order to have access to all possible byte codes (both positive and negative), a differential measurement should be made between the TIA input signal and 2.5V. Therefore when the TIA outputs 5V, the ADC measures a differential signal of 2.5V. And when the TIA outputs 0V (or close to), the ADC measures -2.5V.
- Antialiasing filter Calculation:
  Theoretical maximum over/underbias: +-5V
  Input current limit in conduction: 10mA -> 5 for safety
  1000 ohm minimum
  Datasheet reccomends single stage RC with cutoff ~10x ODR. Max ODR is 4k SPS, So cutoff freq is 40kHz.
  2Kohm/2nF filter provides 39.7kHz cutoff.
- Decoder for IO expansion and to enforce mutual exclusivity on switches
- The integrator output varies from 4.9V (no charge) to nominally -10.1V (full scale). (It can go lower without saturating but this preserves the range from previous designs.) This design with the LT1991 has the transfer function
  Vo = 1.25V (1 + Rf/150k) - Vi (Rf/150k),
  where Rf = 450k || (50k+5.11k) = 45.08k.
  The transfer function can more aggressively approach the bounds of the ADC full-scale range by changing the additional resistor (no more than 6.25k) between pins 6 and 8 (OUT and M9).
- Doubles as input protection
- ADC can be configured to use any two inputs as the differential pair for signal measurement (including AINCOM).
- (near C54) -> Tie CS pin to DGND if CS is not used
  -> Tie the CLK pin to DGND if the internal oscillator is used
  -> Tie the START/SYNC pin to DGND to control conversions by commands
  -> Tie the RESET pin to IOVDD if the RESET pin is not used
  -> If the DRDY output is not used, leave the DRDY pin unconnected or tie the DRDY pin to IOVDD using a weak pullup resistor
- It seems very useful to be able to measure the nominal 4.9V line, since the all the front-end outputs depend on what exactly is on that line. Since the bias voltage cannot be easily measured, that frees up a channel to do so.
- Concerns with these:
  Capacitive loading on the amplifier outputs?
  - This shouldn't be an issue as the decently large R value should decouple the capacitance from the amp outputs
  Offset error?
  - Differential input impedance of this ADC is 1G, so the effective divider formed here only has a 2ppm offset which is already in the noise floor.
  In any case, if these are causing problems adjusting the values or bypassing is easy.
- Compatible LT1991 variants:
  LT1991(A)(C|I|H)MS(#packaging code)
  LT1991A has tighter tolerances in places that would be caught by calibration anyways, so it just makes calibration a little easier.
  C/I/H indicates temperature range. C is 0 to 70C, I is -40 to 85C, H is -40 to 125C. Analog Devices does not currently make an LT1991AH.
- Compatible SiT1602B oscillator variants:
  SiT1602B[C|I][T|-]2[1|2|3][33|XX|YY][E|S|N]4.096000
- The ADC clock can be on the Sergeant, Soldier, or Specialist boards, and exactly one is required across all three boards.
  To have the clock on the Sergeant board, DNP components labelled with A.
  To have the clock on the Soldier board, DNP components labelled with B.
  To have the clock on the Specialist board, DNP components labelled with C.
  In every case, populate every other component within the red border.
- ALTAIR Photodiode Acquisition Payload - Sergeant
- (Based on UVic ORCASat design Rev A.6 by Evan Moore)
- (near J13) Additional MMCX connector can be used for direct low-noise measurement of the TIA output or one of the integrator outputs.

### Library data of the parts
C43 C45 C47 C49 C51 C53 C56 C57 C60 = CAP: Kemet C0603C104K5RACAUTO - Cap Ceramic 0.1uF 50V X7R 10% 0603 125C Paper T/R; MF: Kemet; MP: C0603C104K5RACAUTO
C44 C46 C48 C50 C52 C54 = CAP: Murata GRM21BR61E106KA73L - Cap Ceramic 10uF 10% 25V X5R 0805; MF: Murata; MP: GRM21BR61E106KA73L
C61-C64 = CAP: Cap, Nonpolar, Any, Must choose footprint manually
J13 = MMCX_recp: Conn MMCX F 50Ohm Solder ST SMD Gold Tray; Manufacturer 1: Molex; Manufacturer Part Number 1: 73391-0070; Body Material: Brass; Connector Type: PCB,SMA,Coaxial; Impedance: 50R; Gender: Female; MP: 0734152061; Dielectric Material: PTFE; Max Frequency: 6GHz; Voltage Rating: 170V; RoHS: Yes; Category: RF / Coaxial Connectors; Stock 1: 31911; Mount: Through Hole; Case/Package: SMA; Insulation Material: Teflon; Body Plating: Gold; Contact Material: Copper; Contact Plating: Gold; Plating: Gold; Termination: Solder; Packaging: Bulk; Package Quantity: 1600; Orientation: Straight; Length: 6.08mm; Depth: 6.08mm; Radiation Hardening: No; Lead Free: Lead Free; Halogen Free: Low Halogen; REACH SVHC: Unknown; ComponentLink1URL: https://datasheet.ciiva.com/30257/448910733910070-rf-coax-nectors-30257114.pdf?src-supplier=Onlinecomponents.com; ComponentLink1Description: https://datasheet.ciiva.com/30257/448910733910070-rf-coax-nectors-30257114.pdf?src-supplier=Onlinecomponents.com; ComponentLink2URL: https://datasheet.ciiva.com/5175/0733910070-rf-coax-connectors-173128-5175036.pdf?src-supplier=Mouser; ComponentLink2Description: https://datasheet.ciiva.com/5175/0733910070-rf-coax-connectors-173128-5175036.pdf?src-supplier=Mouser; ComponentLink3URL: https://datasheet.ciiva.com/15172/getdatasheetpartid-226633-15172901.pdf?src-supplier=Verical; ComponentLink3Description: https://datasheet.ciiva.com/15172/getdatasheetpartid-226633-15172901.pdf?src-supplier=Verical; ComponentLink4URL: https://datasheet.ciiva.com/9419/0733910070-rf-coax-connectors-9419351.pdf?src-supplier=Avnet; ComponentLink4Description: https://datasheet.ciiva.com/9419/0733910070-rf-coax-connectors-9419351.pdf?src-supplier=Avnet; ComponentLink5URL: https://datasheet.ciiva.com/16677/0733910070-rf-coax-connectors-16677276.pdf?src-supplier=Avnet+Europe; ComponentLink5Description: https://datasheet.ciiva.com/16677/0733910070-rf-coax-connectors-16677276.pdf?src-supplier=Avnet+Europe; Supplier 1: Digi-Key; Supplier Part Number 1: WM5560-ND; MF: Molex; Pricing 1: 1=2.42000, 10=2.19800, 25=2.06320, 50=1.97360, 100=1.88390, 250=1.70448, 500=1.56992, 1000=1.34565, 2500=1.25594 (USD); Housing Color: Gold; Min Operating Temperature: -55°C; Max Operating Temperature: 165°C; Fastening Type: Snap; ComponentLink6URL: https://datasheet.ciiva.com/15237/133380734152061-rf-coax-nectors-15237680.pdf?src-supplier=Arrow+Europe; ComponentLink6Description: https://datasheet.ciiva.com/15237/133380734152061-rf-coax-nectors-15237680.pdf?src-supplier=Arrow+Europe; ComponentLink7URL: https://datasheet.ciiva.com/18494/734152061-sd-18494866.pdf?src-supplier=Digi-Key; ComponentLink7Description: https://datasheet.ciiva.com/18494/734152061-sd-18494866.pdf?src-supplier=Digi-Key; ComponentLink8URL: https://datasheet.ciiva.com/3951/128690734152061-rf-coax-nectors-3951867.pdf?src-supplier=Arrow+Electronics; ComponentLink8Description: https://datasheet.ciiva.com/3951/128690734152061-rf-coax-nectors-3951867.pdf?src-supplier=Arrow+Electronics
J14 = CMP-207975-000001-3: Rf Coaxial, Mmcx Jack, 50 Ohm, Pcb Rohs Compliant: Yes |Wurth Elektronik 66012002111503; Insulation Resistance: 1GΩ; Impedance: 50Ω; Insertion Loss (dB): 0.25dB; Number of Contacts: 1; Voltage Rating: 170V; Dielectric Material: PTFE; Min Operating Temperature: -55°C; Connector Type: MMCX; Height: 4.6mm; RoHS: Compliant; Insulation Material: PTFE; Max Operating Temperature: 155°C; Contact Material: Gold, Nickel; MF: Wurth Elektronik; MP: 66012002111503
JACF JIVC JTIA = BC020-02-A-0200-0300-L-G: 2x1 Header THT 1mm Pitch; MF: GCT (GLOBAL CONNECTOR TECHNOLOGY); Datasheet Link: https://gct.co/connector/bc020; MP: BC020-02-A-0200-0300-L-G; Mouser Part Number: 640-BC02002A02300LG; Mouser Price/Stock: https://www.mouser.co.uk/ProductDetail/GCT/BC020-02-A-0200-0300-L-G?qs=KUoIvG%2F9IlakgsojlT9P9w%3D%3D
R62 R63 = RES: Panasonic ERA-2AEB5111X - Res 5.11k 0.1% 1/16W SMD 0402; MF: Panasonic Electronic Components; MP: ERA-2AEB5111X
R64 R65 = RES: Stackpole RMCF0402JT47R0 - Res 47Ohm 5% 0.063W 0402 Thick Film AEC-Q200 compliant; MF: Stackpole Electronics Inc.; MP: RMCF0402JT47R0
R66 R67 = RES: Vishay CRCW060310K0FKEA SMD 0603 10k, CRCW e3 Series, 75V, thick film, 100mW; MF: Vishay Dale; MP: CRCW060310K0FKEA
R68-R70 = RES: Yageo RC0402FR-0733RL - Res 33Ohm 1% 1/16W 0402; MF: YAGEO; MP: RC0402FR-0733RL
R71 R72 = RES: Yageo RC0402JR-070RL - Res 0 Ohms 1/16W SMD 0402; MF: YAGEO; MP: RC0402JR-070RL
R73-R76 = RES: Res, Any, Manually select footprint
U1 = LMK1C1103PWR: LVCMOS CLOCK BUFFER 3-CHANNEL; MF: Texas Instruments; MP: LMK1C1103PWR
U2 = ADS124S08IPBSR: 24BIT ADC Delta-Sigma 4k samples/s PGA V-reference; Interface: SPI; Number of Inputs: 12; Number of Bits: 24; Sampling Rate: 4000S/s; Number of A/D Converters: 1; MF: Texas Instruments; RoHS: No; Category: Analog to Digital Converters (ADCs); Stock 1: 2523; Mount: Surface Mount; Case/Package: LQFP; Number of Pins: 32; Min Operating Temperature: -50°C; Max Operating Temperature: 125°C; Packaging: Tape and Reel; ComponentLink1URL: http://www.ti.com/general/docs/lit/getliterature.tsp?genericPartNumber=ADS124S08&fileType=pdf&src-supplier=Farnell; ComponentLink1Description: http://www.ti.com/general/docs/lit/getliterature.tsp?genericPartNumber=ADS124S08&fileType=pdf&src-supplier=Farnell; ComponentLink2URL: http://www.ti.com/lit/ds/symlink/ads124s06.pdf?src-supplier=Digi-Key; ComponentLink2Description: http://www.ti.com/lit/ds/symlink/ads124s06.pdf?src-supplier=Digi-Key; Supplier 1: Digi-Key; Supplier Part Number 1: 296-45170-1-ND; MP: ADS124S08IPBSR
U17 U18 = LT1991IMS#TRPBF: Programmable Gain Amplifier - Single Channel, Precision, -13 to 14 Gain Selectable Operational Amplifier, 0.56 MHz Typical GBW, 0.12 V/us Typical SR, 2.4 to 40 V, 10-Pin SOP (MS-10), Industial, Pb-Free, Reel; Linear Technology Part Number: LT1991; MF: Linear Technology; Vos (mV) Guaranteed: 0.05; Channels (#): 1; Is (mA) Typical: 0.1; Vs Max (V): 40; Vos (mV) Typical: 0.015; Vs Min (V): 2.4; MP: LT1991AIMS#PBF; GBW (MHz) Typical: 0.56; SR (V/us) Typical: 0.12; ComponentLink1Description: Manufacturer URL; PackageVersion: Rev E; PackageDescription: 10-Lead Plastic MSOP, Body 3 x 3 mm, Pitch 0.5 mm; ComponentLink1URL: http://www.linear.com/; Mounting Technology: Surface Mount; Type: SGA; RoHS: Pb-Free; ComponentLink3URL: http://cds.linear.com/docs/en/packaging/MSOP_10_05-08-1661.pdf; ComponentLink3Description: Package Specification; ComponentLink2Description: Datasheet; DatasheetVersion: Rev. H; ComponentLink2URL: http://cds.linear.com/docs/en/datasheet/1991fh.pdf; Packing: Reel; RevisionNote: URLs updated; PackageReference: LT-MS-10
U19 = CMP-0859-00546-3: 2-Line-to-4-Line Decoder, DCT0008A, SMALL T&R; Manufacturer: Texas Instruments; Input Type: CMOS/TTL; VCC(Max)(V): 5.5; Specialty Logic Family: Decoder/Encoder/Multiplexer; ICC @ Nom Voltage(Max)(mA): 0.01; Schmitt Trigger: No; Technology Family: LVC; Bits(#): 1; Output Drive (IOL/IOH)(Max)(mA): 32/-32; Output Type: CMOS; Rating: Catalog; Voltage(Nom)(V): 1.8,2.5,3.3,5; F @ Nom Voltage(Max)(Mhz): 150; VCC(Min)(V): 1.65; tpd @ Nom Voltage(Max)(ns): 16.5,7.5,4.9,3.6; Logic: True; DatasheetVersion: SCES602C; Sub-Family: Decoder/Encoder/Multiplexer; 3-State Output: No; PackageReference: DCT0008A; Generic Part Number: SN74LVC1G139; Operating Temperature Range(C): -40 to 85
Y1 = SIT1602Bx: MEMS OSC XO 4.096MHZ H/LVCMOS; Max Supply Current: 4.5mA; MF: SiTime; MP: SiT1602BC-21-XXN-4.096000; RoHS Compliant: Yes; Width: 0.098inch; Height: 0.032inch; Mount: Surface Mount; Series: SIT1602; Case/Package: SMD/SMT

## Nets that join several sheets
3V3: BoardInterfaces_SarSol (R1.1 U14.2), ADC_SarSol (10 pins)
4V9: Power_SarSol (6 pins), BoardInterfaces_SarSol (C27.1 U12.9), TIA_SarSol (7 pins), Integrators_SarSol (8 pins), ADC_SarSol (R76.1)
5VTIA: Power_SarSol (C65.1 U20.4 U20.5), TIA_SarSol (C28.2 C29.2 U13.5)
10V: Power_SarSol (18 pins), BoardInterfaces_SarSol (C27.2 U12.16), TIA_SarSol (C22.2 C23.2 U9.4), Integrators_SarSol (C37.2 C38.2 U15.14), ADC_SarSol (6 pins)
-11V: Power_SarSol (5 pins), Integrators_SarSol (C39.2 C40.2 U15.9), ADC_SarSol (6 pins)
A2V5: Power_SarSol (C8.2 C24.1 TP2.1 U10.6), ADC_SarSol (U2.7 U2.30 U17.1 U18.1)
A5VSW: Power_SarSol (TP6.1 U5.6 U5.7), BoardInterfaces_SarSol (C26.2 U12.1), TIA_SarSol (8 pins)
AVDD: Power_SarSol (5 pins), TIA_SarSol (R44.2 R51.2), ADC_SarSol (5 pins)
SYS_GND: Power_SarSol (45 pins), BoardInterfaces_SarSol (26 pins), TIA_SarSol (20 pins), ADC_SarSol (35 pins)
ACF_SWA_IN: TIA_SarSol (K2.3), Integrators_SarSol (J8.1)
ADC_CLK: BoardInterfaces_SarSol (J2.13), ADC_SarSol (R68.1 R71.2)
GUARD: TIA_SarSol (J6.4 U13.2 U13.7), Integrators_SarSol (J3.1 J5.1 J16.1 J17.1)
IVC_SW_IN: TIA_SarSol (K4.3), Integrators_SarSol (U15.2)
NEG_SW: Power_SarSol (R19.2 R20.2), ADC_SarSol (U2.22)
NetJ9_1: Integrators_SarSol (J9.1), ADC_SarSol (U17.9)
NetR1_2: BoardInterfaces_SarSol (R1.2 R2.2), ADC_SarSol (U2.18)
NetR3_2: BoardInterfaces_SarSol (R3.2 R4.2), ADC_SarSol (R65.2)
NetR6_2: BoardInterfaces_SarSol (R6.2 R7.2 R8.1), ADC_SarSol (U2.8)
NetR12_2: BoardInterfaces_SarSol (R12.2 R13.2), ADC_SarSol (U2.9)
NetR36_2: TIA_SarSol (R36.2), ADC_SarSol (U19.5)
NetR38_2: TIA_SarSol (R38.2), ADC_SarSol (U19.6)
NetR39_2: TIA_SarSol (R39.2), ADC_SarSol (U19.3)
NetR42_2: TIA_SarSol (R42.2), ADC_SarSol (U2.19)
NetR48_1: TIA_SarSol (R48.1), ADC_SarSol (U2.31)
NetR50_1: TIA_SarSol (R50.1), ADC_SarSol (U2.32)
NetU9_1: BoardInterfaces_SarSol (U12.15), TIA_SarSol (U9.1)
NetU9_2: BoardInterfaces_SarSol (U12.14), TIA_SarSol (U9.2)
NetU9_3: BoardInterfaces_SarSol (U12.13), TIA_SarSol (U9.3)
NetU12_11: BoardInterfaces_SarSol (U12.11), Integrators_SarSol (U15.12)
NetU12_12: BoardInterfaces_SarSol (U12.12), Integrators_SarSol (U15.11)
NetU15_10: Integrators_SarSol (U15.10), ADC_SarSol (U18.9)
rSPI_MOSI: BoardInterfaces_SarSol (R5.2 U12.4), ADC_SarSol (U2.10)
rSPI_SCLK: BoardInterfaces_SarSol (R11.2 U12.3), ADC_SarSol (U2.11)
SPI_MISO: BoardInterfaces_SarSol (J1.11 J2.11), ADC_SarSol (R64.2)
TIA_OUT: TIA_SarSol (C30.2 K6.3 R45.2 U13.6), ADC_SarSol (JTIA.1 R73.1)
VBAT: Power_SarSol (11 pins), BoardInterfaces_SarSol (U11.2)